# EAGLE design SmartSwitch_i2c_mux (EAGLE 6.4)
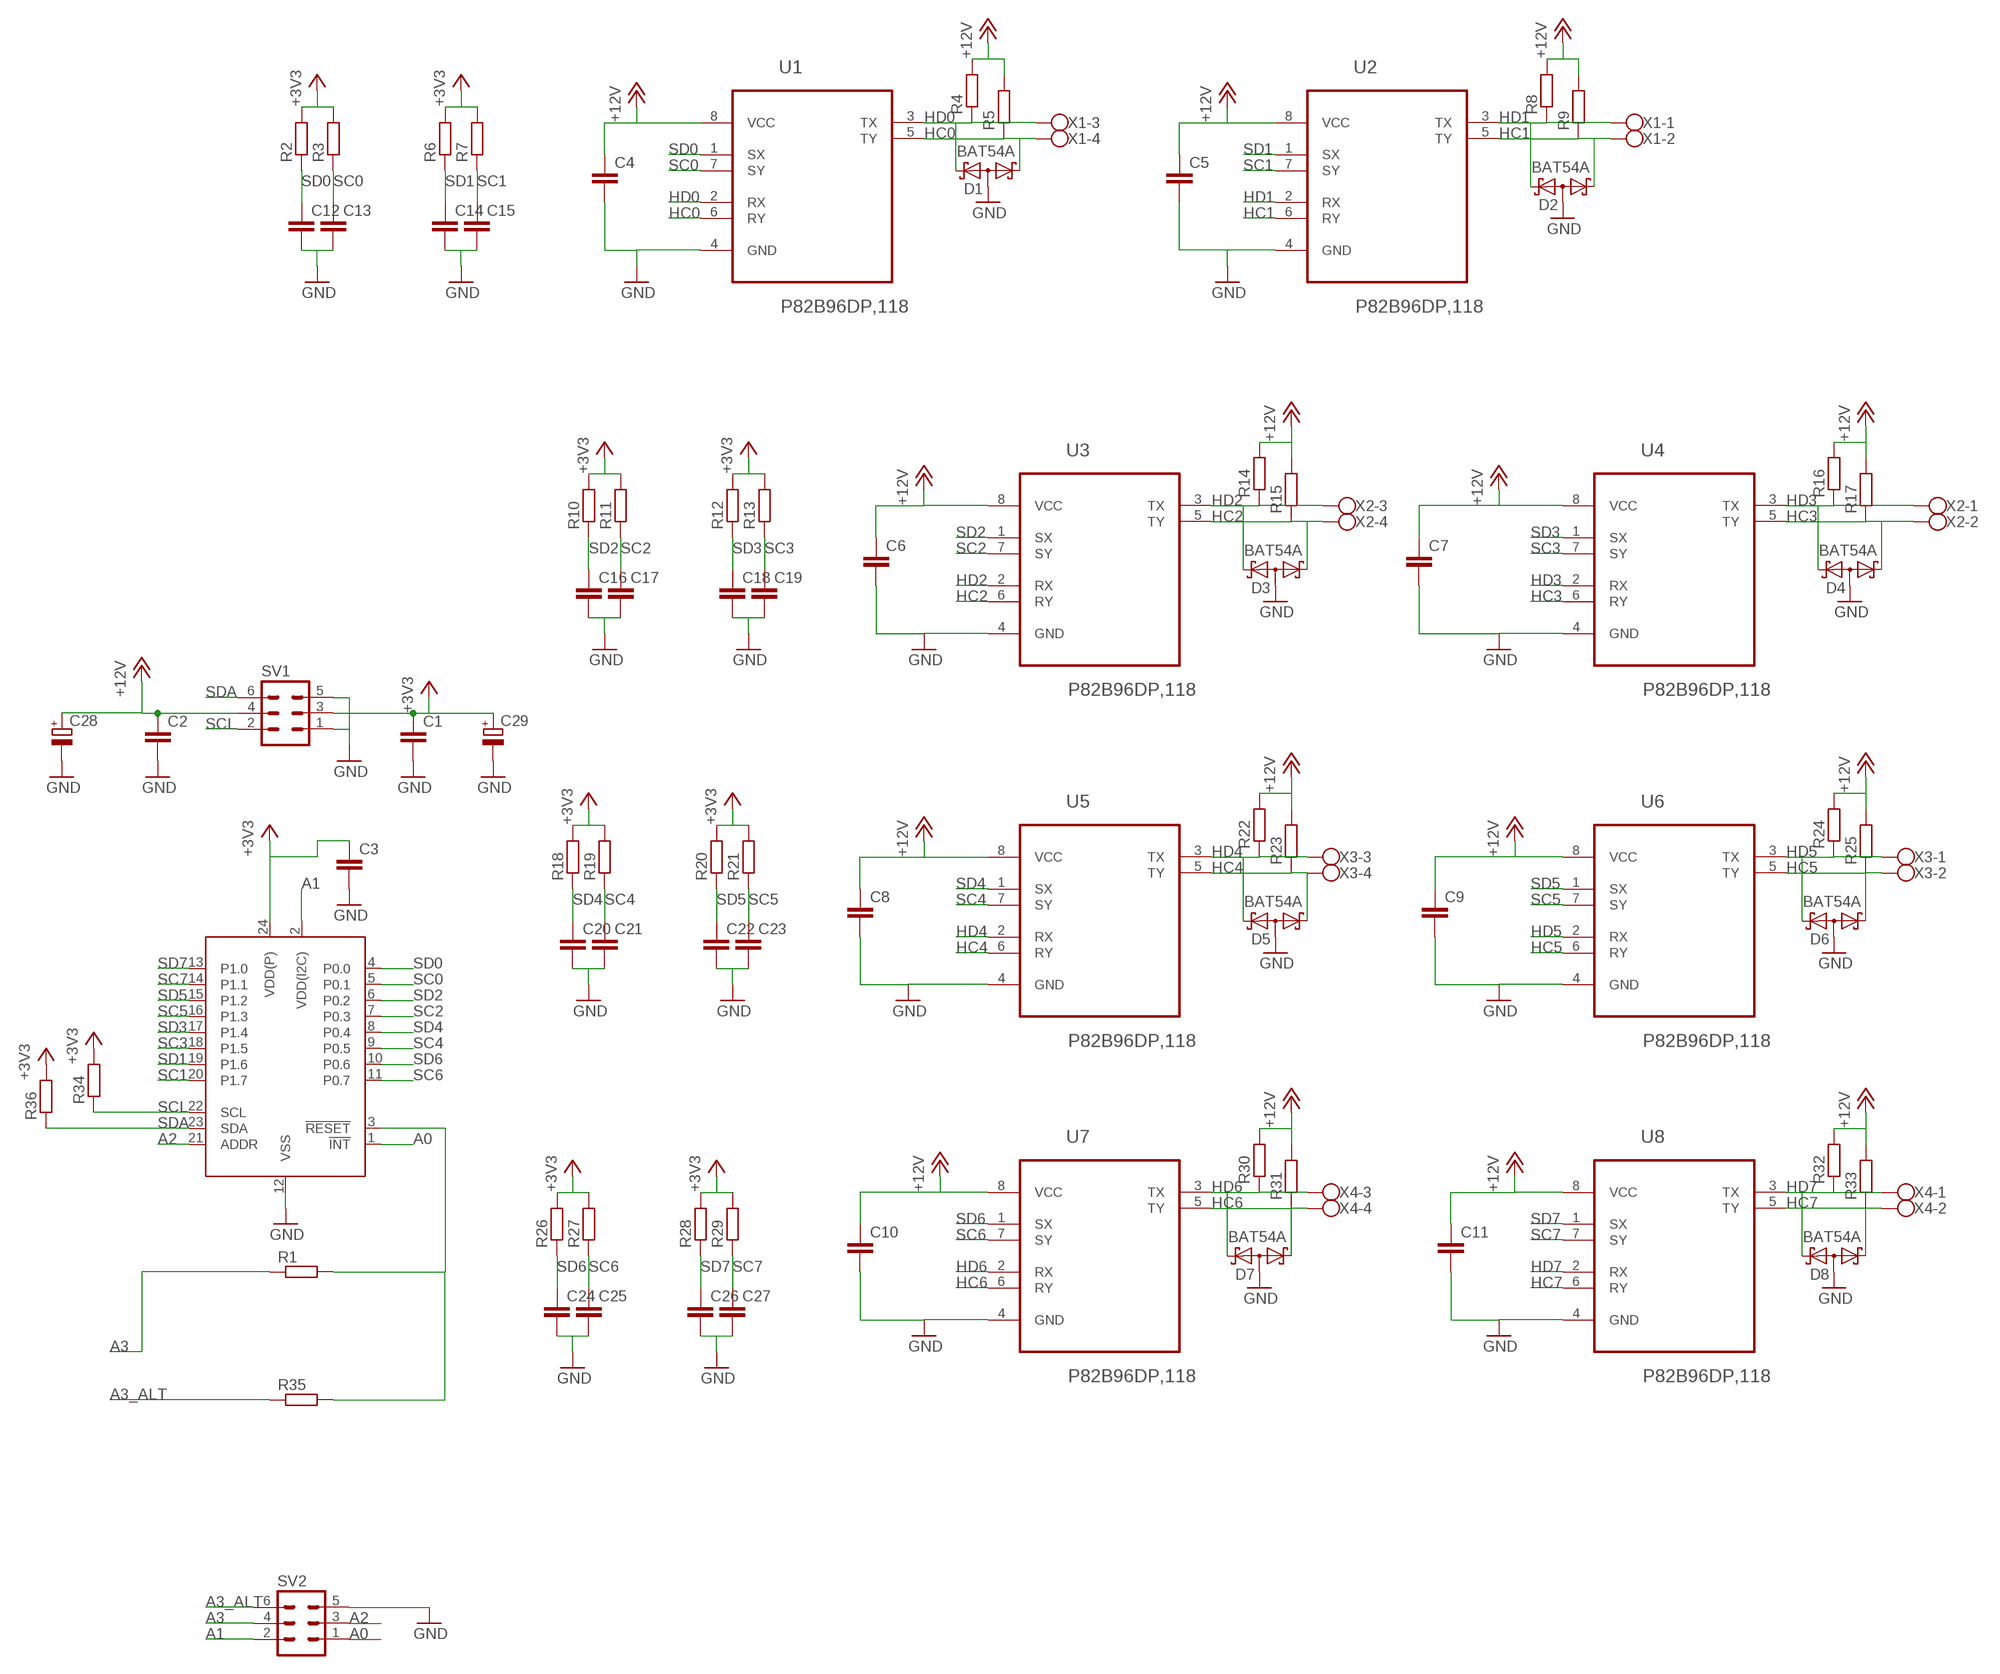
[diagram p0: schematic, sheet 1]

## Parts
C1  C-EUC0805K  [C0805K]
C2  C-EUC0805K  [C0805K]
C3  C-EUC0603K  [C0603K]
C4  C-EUC0603K  [C0603K]
C5  C-EUC0603K  [C0603K]
C6  C-EUC0603K  [C0603K]
C7  C-EUC0603K  [C0603K]
C8  C-EUC0603K  [C0603K]
C9  C-EUC0603K  [C0603K]
C10  C-EUC0603K  [C0603K]
C11  C-EUC0603K  [C0603K]
C12  C-EUC0402  [C0402]
C13  C-EUC0402  [C0402]
C14  C-EUC0402  [C0402]
C15  C-EUC0402  [C0402]
C16  C-EUC0402  [C0402]
C17  C-EUC0402  [C0402]
C18  C-EUC0402  [C0402]
C19  C-EUC0402  [C0402]
C20  C-EUC0402  [C0402]
C21  C-EUC0402  [C0402]
C22  C-EUC0402  [C0402]
C23  C-EUC0402  [C0402]
C24  C-EUC0402  [C0402]
C25  C-EUC0402  [C0402]
C26  C-EUC0402  [C0402]
C27  C-EUC0402  [C0402]
C28  CPOL-EUUD-6,3X7,7  [UD-6,3X7,7_NICHICON]
C29  CPOL-EUUD-6,3X7,7  [UD-6,3X7,7_NICHICON]
D1  BAT54A  [SOT23]
D2  BAT54A  [SOT23]
D3  BAT54A  [SOT23]
D4  BAT54A  [SOT23]
D5  BAT54A  [SOT23]
D6  BAT54A  [SOT23]
D7  BAT54A  [SOT23]
D8  BAT54A  [SOT23]
R1  R-EU_R0402  [R0402]
R2  R-EU_R0603  [R0603]
R3  R-EU_R0603  [R0603]
R4  R-EU_R1206  [R1206]
R5  R-EU_R1206  [R1206]
R6  R-EU_R0603  [R0603]
R7  R-EU_R0603  [R0603]
R8  R-EU_R1206  [R1206]
R9  R-EU_R1206  [R1206]
R10  R-EU_R0603  [R0603]
R11  R-EU_R0603  [R0603]
R12  R-EU_R0603  [R0603]
R13  R-EU_R0603  [R0603]
R14  R-EU_R1206  [R1206]
R15  R-EU_R1206  [R1206]
R16  R-EU_R1206  [R1206]
R17  R-EU_R1206  [R1206]
R18  R-EU_R0603  [R0603]
R19  R-EU_R0603  [R0603]
R20  R-EU_R0603  [R0603]
R21  R-EU_R0603  [R0603]
R22  R-EU_R1206  [R1206]
R23  R-EU_R1206  [R1206]
R24  R-EU_R1206  [R1206]
R25  R-EU_R1206  [R1206]
R26  R-EU_R0603  [R0603]
R27  R-EU_R0603  [R0603]
R28  R-EU_R0603  [R0603]
R29  R-EU_R0603  [R0603]
R30  R-EU_R1206  [R1206]
R31  R-EU_R1206  [R1206]
R32  R-EU_R1206  [R1206]
R33  R-EU_R1206  [R1206]
R34  R-EU_R0603  [R0603]
R35  R-EU_R0402  [R0402]
R36  R-EU_R0603  [R0603]
SV1  MA03-2  [MA03-2]
SV2  MA03-2  [MA03-2]
U1  P82B96DP,118  [SOP65P490X110-8N]
U2  P82B96DP,118  [SOP65P490X110-8N]
U3  P82B96DP,118  [SOP65P490X110-8N]
U4  P82B96DP,118  [SOP65P490X110-8N]
U5  P82B96DP,118  [SOP65P490X110-8N]
U6  P82B96DP,118  [SOP65P490X110-8N]
U7  P82B96DP,118  [SOP65P490X110-8N]
U8  P82B96DP,118  [SOP65P490X110-8N]
U10  PCAL6416APW  [SOT355-1]
X1  W237-4  [W237-4]
X2  W237-4  [W237-4]
X3  W237-4  [W237-4]
X4  W237-4  [W237-4]

## Nets
+3V3: C1.1 C3.1 C29.+ R2.2 R3.2 R6.2 R7.2 R10.2 R11.2 R12.2 R13.2 R18.2 R19.2 R20.2 R21.2 R26.2 R27.2 R28.2 R29.2 R34.2 R36.2 SV1.3 U10.24(VDD(P))
+12V: C2.1 C4.1 C5.1 C6.1 C7.1 C8.1 C9.1 C10.1 C11.1 C28.+ R4.2 R5.2 R8.2 R9.2 R14.2 R15.2 R16.2 R17.2 R22.2 R23.2 R24.2 R25.2 R30.2 R31.2 R32.2 R33.2 SV1.4 U1.8(VCC) U2.8(VCC) U3.8(VCC) U4.8(VCC) U5.8(VCC) U6.8(VCC) U7.8(VCC) U8.8(VCC)
A0: SV2.1 U10.1(!INT!)
A1: SV2.2 U10.2(VDD(I2C))
A2: SV2.3 U10.21(ADDR)
A3: R1.1 SV2.4
A3_ALT: R35.1 SV2.6
GND: C1.2 C2.2 C3.2 C4.2 C5.2 C6.2 C7.2 C8.2 C9.2 C10.2 C11.2 C12.2 C13.2 C14.2 C15.2 C16.2 C17.2 C18.2 C19.2 C20.2 C21.2 C22.2 C23.2 C24.2 C25.2 C26.2 C27.2 C28.- C29.- D1.3(A1A2) D2.3(A1A2) D3.3(A1A2) D4.3(A1A2) D5.3(A1A2) D6.3(A1A2) D7.3(A1A2) D8.3(A1A2) SV1.1 SV1.5 SV2.5 U1.4(GND) U2.4(GND) U3.4(GND) U4.4(GND) U5.4(GND) U6.4(GND) U7.4(GND) U8.4(GND) U10.12(VSS)
HC0: D1.1(K1) R5.1 U1.5(TY) U1.6(RY) X1.4
HC1: D2.1(K1) R9.1 U2.5(TY) U2.6(RY) X1.2
HC2: D3.1(K1) R15.1 U3.5(TY) U3.6(RY) X2.4
HC3: D4.1(K1) R17.1 U4.5(TY) U4.6(RY) X2.2
HC4: D5.1(K1) R23.1 U5.5(TY) U5.6(RY) X3.4
HC5: D6.1(K1) R25.1 U6.5(TY) U6.6(RY) X3.2
HC6: D7.1(K1) R31.1 U7.5(TY) U7.6(RY) X4.4
HC7: D8.1(K1) R33.1 U8.5(TY) U8.6(RY) X4.2
HD0: D1.2(K2) R4.1 U1.2(RX) U1.3(TX) X1.3
HD1: D2.2(K2) R8.1 U2.2(RX) U2.3(TX) X1.1
HD2: D3.2(K2) R14.1 U3.2(RX) U3.3(TX) X2.3
HD3: D4.2(K2) R16.1 U4.2(RX) U4.3(TX) X2.1
HD4: D5.2(K2) R22.1 U5.2(RX) U5.3(TX) X3.3
HD5: D6.2(K2) R24.1 U6.2(RX) U6.3(TX) X3.1
HD6: D7.2(K2) R30.1 U7.2(RX) U7.3(TX) X4.3
HD7: D8.2(K2) R32.1 U8.2(RX) U8.3(TX) X4.1
N$1: R1.2 R35.2 U10.3(!RESET!)
SC0: C13.1 R3.1 U1.7(SY) U10.5(P0.1)
SC1: C15.1 R7.1 U2.7(SY) U10.20(P1.7)
SC2: C17.1 R11.1 U3.7(SY) U10.7(P0.3)
SC3: C19.1 R13.1 U4.7(SY) U10.18(P1.5)
SC4: C21.1 R19.1 U5.7(SY) U10.9(P0.5)
SC5: C23.1 R21.1 U6.7(SY) U10.16(P1.3)
SC6: C25.1 R27.1 U7.7(SY) U10.11(P0.7)
SC7: C27.1 R29.1 U8.7(SY) U10.14(P1.1)
SCL: R34.1 SV1.2 U10.22(SCL)
SD0: C12.1 R2.1 U1.1(SX) U10.4(P0.0)
SD1: C14.1 R6.1 U2.1(SX) U10.19(P1.6)
SD2: C16.1 R10.1 U3.1(SX) U10.6(P0.2)
SD3: C18.1 R12.1 U4.1(SX) U10.17(P1.4)
SD4: C20.1 R18.1 U5.1(SX) U10.8(P0.4)
SD5: C22.1 R20.1 U6.1(SX) U10.15(P1.2)
SD6: C24.1 R26.1 U7.1(SX) U10.10(P0.6)
SD7: C26.1 R28.1 U8.1(SX) U10.13(P1.0)
SDA: R36.1 SV1.6 U10.23(SDA)

## Library data of the parts
C1-C27 = billyInd:C-EU: CAPACITOR, European symbol
C28 C29 = billyInd:CPOL-EU: POLARIZED CAPACITOR, European symbol
D1-D8 = NXP_60_26022015:BAT54A: Schottky barrier (double) diodes Planar Schottky barrier diodes encapsulated in a SOT23 small plastic SMD package. Single diodes and double diodes with different pinning are available. AAL Eindhoven MK
R1-R36 = billyInd:R-EU_: RESISTOR, European symbol
SV1 SV2 = con-lstb:MA03-2: PIN HEADER; OC_FARNELL: unknown; OC_NEWARK: unknown
U1-U8 = NXP_By_element14_Batch_1:P82B96DP,118: Dual bidirectional bus buffer; MPN: P82B96DP,118; OC_FARNELL: 1831235; OC_NEWARK: 70R8458; PACKAGE: TSSOP-8; SUPPLIER: NXP Semiconductors
U10 = NXP_60_26022015:PCAL6416A: Low-voltage translating 16-bit I2C-bus/SMBus I/O expander with interrupt output, reset, and configuration registers The PCAL6416A is a 16-bit general-purpose I/O expander that provides remote I/O expansion for most microcontroller families via the I2C-bus interface. NXP I/O expanders provide a simple solution when additional I/Os are needed while keeping interconnections to a minimum, for example, in battery-powered mobile applications for interfacing to sensors, push buttons, keypad, etc. In addition to providing a flexible set of GPIOs, it simplifies interconnection of a processor running at one voltage level to I/O devices operating at a different (usually higher) voltage level. The PCAL6416A has built-in level shifting feature that makes these devices extremely flexible in mixed signal environments where communication between incompatible I/O voltages is required. Its wide VDD range of 1.65 V to 5.5 V on the dual power rail allows seamless communications with next-generation low voltage microprocessors and microcontrollers on the interface side (SDA/SCL) and peripherals at a higher voltage on the port side. There are two supply voltages for PCAL6416A: VDD(I2C-bus) and VDD(P). VDD(I2C-bus) provides the supply voltage for the interface at the master side (for example, a microcontroller) and the VDD(P) provides the supply for core circuits and Port P. The bidirectional voltage level translation in the PCAL6416A is provided through VDD(I2C-bus). VDD(I2C-bus) should be connected to the VDD of the external SCL/SDA lines. This indicates the VDD level of the I2C-bus to the PCAL6416A, while the voltage level on Port P of the PCAL6416A is determined by the VDD(P). The PCAL6416A contains the PCA6416A register set of four pairs of 8-bit Configuration, Input, Output, and Polarity Inversion registers and additionally, the PCAL6416A has Agile I/O, which are additional features specifically designed to enhance the I/O. These additional features are: programmable output drive strength, latchable inputs, programmable pull-up/pull-down resistors, maskable interrupt, interrupt status register, programmable open-drain or push-pull outputs. The PCAL6416A is a pin-to-pin replacement to the PCA6416A, however, the PCAL6416A powers up with all I/O interrupts masked. This mask default allows for a board bring-up free of spurious interrupts at power-up. At power-on, the I/Os are configured as inputs. However, the system master can enable the I/Os as either inputs or outputs by writing to the I/O configuration bits. The data for each input or output is kept in the corresponding input or output register. The polarity of the Input Port register can be inverted with the Polarity Inversion register, saving external logic gates. Programmable pull-up and pull-down resistors eliminate the need for discrete components. AAL Eindhoven MK
X1-X4 = strip_connector_billy:W237-4: WAGO SCREW CLAMP; OC_FARNELL: unknown; OC_NEWARK: unknown

## Board
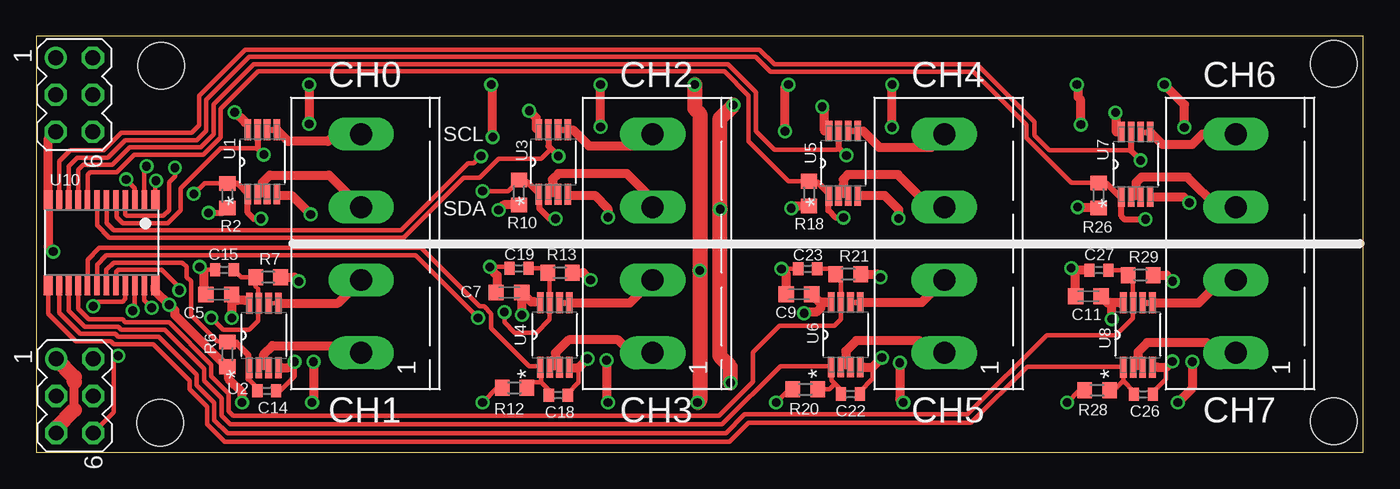
[diagram p1: board, top side]
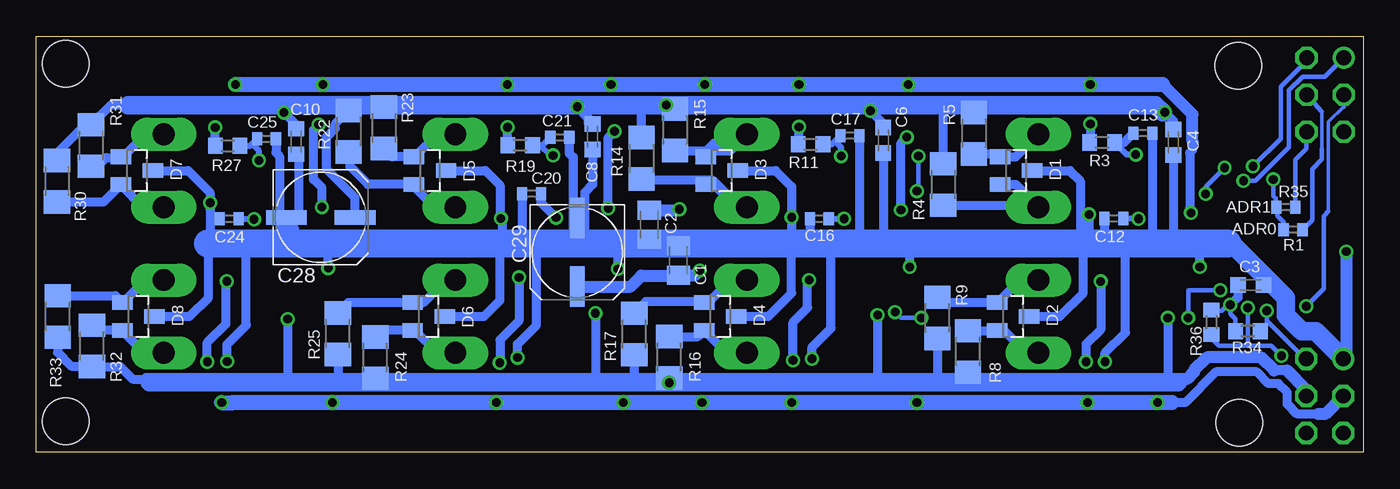
[diagram p2: board, bottom side, seen from below]

Size 91 x 28.5 mm. Coordinates in mm from the lower left corner, seen from the top.
Outline: 0,0 91,0 91,28.5 0,28.5 0,0
Copper layers (1*16): Top 0.0356mm / dielectric 1.5011mm / Bottom 0.0356mm
Design rules "LaenPCBOrder *": minimum track width 6mil, minimum drill 13mil, track to track 6mil, track to pad 6mil, pad to pad 6mil, via to via 6mil, smd to smd 6mil, copper to edge 15mil, drill to drill 6mil, minimum pad ring 7mil, minimum via ring 7mil, stop-mask expansion 4mil, vias tented up to drill 24mil, thermal gap 10mil
Holes 3.2 mm at 8.5,2 8.55,26.5 89,2.12 89,26.62

### Footprints (pad centres in the part's own frame; a part is rotated, then mirrored left to right if it is on the bottom)
C0805K = smd 1.3 x 1.6: 1 -1,0; 2 1,0
C0603K = smd 1.05 x 1.08: 1 -0.875,0; 2 0.875,0
C0402 = smd 0.7 x 0.9: 1 -0.65,0; 2 0.65,0
UD-6,3X7,7_NICHICON = smd 2.8 x 1: + 2.35,0; - -2.35,0
SOT23 = smd 1 x 1.4: 1 -0.95,-1.1; 2 0.95,-1.1; 3 0,1.1
R0402 = smd 0.7 x 0.9: 1 -0.65,0; 2 0.65,0
R0603 = smd 1 x 1.1: 1 -0.85,0; 2 0.85,0
R1206 = smd 1.6 x 1.803: 1 -1.422,0; 2 1.422,0
MA03-2 = drill 1.016: 1 -2.54,-1.27 | drill 1.016 octagon: 2 -2.54,1.27; 3 0,-1.27; 4 0,1.27; 5 2.54,-1.27; 6 2.54,1.27
SOP65P490X110-8N = smd 1.422 x 0.457: 1 -2.21,0.991; 2 -2.21,0.33; 3 -2.21,-0.33; 4 -2.21,-0.991; 5 2.21,-0.991; 6 2.21,-0.33; 7 2.21,0.33; 8 2.21,0.991
SOT355-1 = smd 0.6 x 1.35: 1 -3.675,-2.925; 12 3.675,-2.925; 13 3.675,2.925; 24 -3.675,2.925 | smd 0.4 x 1.35: 2 -2.925,-2.925; 3 -2.275,-2.925; 4 -1.625,-2.925; 5 -0.975,-2.925; 6 -0.325,-2.925; 7 0.325,-2.925; 8 0.975,-2.925; 9 1.625,-2.925; 10 2.275,-2.925; 11 2.925,-2.925; 14 2.925,2.925; 15 2.275,2.925; 16 1.625,2.925; 17 0.975,2.925; 18 0.325,2.925; 19 -0.325,2.925; 20 -0.975,2.925; 21 -1.625,2.925; 22 -2.275,2.925; 23 -2.925,2.925
W237-4 = drill 1.5 long: 1 -7.5,-1.27; 2 -2.5,-1.27; 3 2.5,-1.27; 4 7.5,-1.27

### Placement (x,y rotation side)
C1  46.96,13.14 90 bottom
C2  48.96,15.59 270 bottom
C3  7.71,11.46 0 bottom
C4  13.01,21.24 270 bottom
C5  12.51,10.81 180 top
C6  32.91,21.38 270 bottom
C7  32.41,10.95 180 top
C8  52.85,21.62 270 bottom
C9  52.31,10.83 180 top
C10  73.19,21.3 270 bottom
C11  72.15,10.69 180 top
C12  17.1,16.02 180 bottom
C13  15.1,21.87 0 bottom
C14  15.8,4.2 0 top
C15  12.9,12.5 180 top
C16  37.3,16 180 bottom
C17  35.2,21.7 0 bottom
C18  35.8,3.9 0 top
C19  33.1,12.6 180 top
C20  57.04,17.72 180 bottom
C21  55.1,21.58 0 bottom
C22  55.84,3.98 0 top
C23  52.9,12.56 180 top
C24  77.78,16 180 bottom
C25  75.22,21.48 0 bottom
C26  75.92,3.96 0 top
C27  72.88,12.48 180 top
C28  71.5,16.1 0 bottom
C29  53.9,13.7 270 bottom
D1  23.8,19.3 270 bottom
D2  24,9.3 270 bottom
D3  44,19.3 270 bottom
D4  44.1,9.3 270 bottom
D5  64,19.3 270 bottom
D6  64.1,9.3 270 bottom
D7  84.1,19.3 270 bottom
D8  84,9.3 270 bottom
R1  4.8,15.25 180 bottom
R2  13.1,17.58 270 top
R3  17.9,21.23 180 bottom
R4  28.8,18.35 90 bottom
R5  26.7,21.87 90 bottom
R6  13.1,6.7 270 top
R7  15.9,12 0 top
R8  27.1,6.9 270 bottom
R9  29.2,9.2 270 bottom
R10  33.1,17.8 270 top
R11  37.9,21.1 180 bottom
R12  32.8,4.4 180 top
R13  35.92,12.3 0 top
R14  49.5,20.15 90 bottom
R15  47.2,22.1 90 bottom
R16  47.6,6.5 270 bottom
R17  50,8.1 270 bottom
R18  53,17.72 270 top
R19  57.82,21.04 180 bottom
R20  52.74,4.3 180 top
R21  55.68,12.2 0 top
R22  69.58,22 90 bottom
R23  67.16,22.24 90 bottom
R24  67.76,6.48 270 bottom
R25  70.32,8.12 270 bottom
R26  72.86,17.6 270 top
R27  77.88,21 180 bottom
R28  72.76,4.24 180 top
R29  75.74,12.14 0 top
R30  89.6,18.58 90 bottom
R31  87.26,21.02 90 bottom
R32  87.2,7.28 270 bottom
R33  89.54,9.3 270 bottom
R34  7.9,8.3 180 bottom
R35  5.3,16.8 180 bottom
R36  10.4,8.9 90 bottom
SV1  2.62,3.85 270 top
SV2  2.6,24.5 270 top
U1  15.5,19.9 90 top
U2  15.6,8 90 top
U3  35.45,19.89 90 top
U4  35.55,8.03 90 top
U5  55.35,19.81 90 top
U6  55.51,8.05 90 top
U7  75.41,19.73 90 top
U8  75.55,8.03 90 top
U10  4.48,14.37 180 top
X1  21,14.3 90 top
X2  41,14.3 90 top
X3  61,14.3 90 top
X4  81,14.3 90 top

### Tracks (layer width: path | path; a pad name or v marks a point on that pad's centre or on a via)
+3V3  (via drill 0.6)
  Top 0.305: R12.2 31.6,4.4 v30.6,3.4 | R20.2 51.64,4.3 v50.74,3.4 | R28.2 71.54,4.24 v70.7,3.4
  Top 0.406: v11.8,16.4 12.77,16.4 R2.2
  Top 0.61: v19,6.2 19,3.5 v18.9,3.4 | v18.7,25.2 v18.7,22.5 | v38.7,22.3 v38.7,25.2 | R10.2 32.05,16.95 v31.7,16.6 | v31.3,21.6 31.3,25.1 v31.2,25.2 | v39.1,6.3 39.1,3.5 v39.2,3.4 | v14.1,3.4 14.1,4.1 13.2,5 13.2,5.75 R6.2 13.05,5.85 9.5,9.4 9.5,9.7 v9.1,10.1 8.15,11.04 U10.24 | v58.68,22.28 58.68,25.18 v58.7,25.2 | R18.2 51.93,16.87 v51.78,16.72 | v51.34,22 51.34,24.96 v51.58,25.2 | R21.2 57.68,12.2 v57.9,11.98 | v59.22,6.12 59.22,3.64 v59.46,3.4 | v78.74,22.26 78.74,23.82 v77.36,25.2 | R26.2 71.47,16.75 v71.42,16.8 | v71.36,25.2 71.44,25.12 71.44,24.36 71.6,24.2 71.6,22.5 v71.64,22.46 | v79.28,6.2 79.28,4.38 v78.3,3.4 | R13.2 37.5,12.3 v38,11.8 | R7.2 17.7,12 v18,11.7 | R29.2 77.52,12.14 v77.94,11.72
  Top 1.016: v45.15,25.2 45.15,23.55 45.5,23.2 v45.5,12.45 45.5,3.55 v45.35,3.4
  Bottom 0.254: 15.68,25.22 14.14,25.24 14.56,25.1 | v71.64,22.46 71.64,22.34 72,22.1
  Bottom 0.305: 75.44,3.34 77.52,3.4 | 10.05,10.1 R36.2 10.35,9.7 9.7,9.7 9.3,10.1 v9.1,10.1 9.1,9.5 8.75,9.15 R34.2
  Bottom 0.406: 11.7,16.5 v11.8,16.4 11.7,16.3 | 11.88,17.78 11.88,17.18 11.8,16.3 11.7,16.3 | 11.9,16.7 11.7,16.3
  Bottom 0.61: v18.7,22.5 18.7,21.48 R3.2 | R11.2 38.7,21.1 v38.7,22.3 | v31.7,16.6 31.7,21.2 v31.3,21.6 | 11.7,21.3 11.7,20.7 11.9,20.5 11.9,16.7 11.9,16.5 v11.8,16.4 | 3.1,2.6 4.5,2.6 5.2,3.3 5.2,4.1 5.8,4.7 6.5,4.7 7.3,5.5 10.1,5.5 12.2,3.4 13.1,3.4 | R19.2 v58.67,22.27 v58.68,22.28 | v51.78,16.72 51.78,21.56 v51.34,22 | R27.2 v78.73,22.25 v78.74,22.26 | v39.1,6.3 39.1,8.9 38.1,9.9 38.1,11.7 v38,11.8 | v18,11.7 18,8.4 19,7.4 v19,6.2 | v57.9,11.98 57.9,9 59.2,7.7 59.2,6.14 v59.22,6.12 | v79.28,6.2 79.28,7.52 78,8.8 78,11.66 v77.94,11.72 | C3.1 8.59,10.62 v9.1,10.1 | v71.42,16.8 71.42,18.12 72,18.7 72,22.1 v71.64,22.46
  Bottom 0.813: SV1.3 2.6,2.6 3.1,2.6 | 11.7,21.3 11.7,23.16 13.74,25.2 15.66,25.2 15.68,25.22 | v45.5,12.45 45.81,12.14 C1.1 47,12.1 49.5,12.1 50.25,11.35 C29.+
  Bottom 1.016: 13.1,3.4 v14.1,3.4 v18.9,3.4 v30.6,3.4 v39.2,3.4 v45.35,3.4 v50.74,3.4 v59.46,3.4 v70.7,3.4 77.52,3.4 v78.3,3.4 | 13.74,25.2 v18.7,25.2 v31.2,25.2 v38.7,25.2 v45.15,25.2 v51.58,25.2 v58.7,25.2 v71.36,25.2 v77.36,25.2
+12V  (via drill 0.6)
  Top 0.305: U1.8 | 13.38,9.21 v13.4,9.2 | U2.8 14.49,10.21 14.3,10.4 | U4.8 34.26,10.24 34.2,10.3 | U6.8 54.22,10.26 | 54.22,10.26 | U8.8 74.2,10.24 74.32,10.24
  Top 0.406: U1.8 14.51,22.39 14.3,22.6 | U3.8 34.4,22.1 34.3,22.2 | U5.8 54.06,22.02 | 54.06,22.02 | U7.8 74.08,21.94 | 74.08,21.94
  Top 0.61: 13.38,9.21 C5.1 13.79,10.4 14.3,10.4 | 34.2,10.3 33.94,10.3 C7.1 33.28,9.41 v33.3,9.4 | 14.3,22.6 v13.6,23.3 | 34.3,22.2 34.3,22.9 v33.8,23.4 | 54.22,10.26 53.76,10.26 C9.1 53.19,10.81 53.78,10.22 53.78,9.88 53.5,9.6 52.74,9.6 v52.66,9.52 | 74.08,21.94 74.08,23.22 v74.02,23.28 | 74.32,10.24 73.68,10.24 | 73.68,10.24 73.47,10.24 C11.1 73.03,10.46 | v73.76,9.12 73.76,10.16 73.68,10.24 | 54.06,22.02 54.06,23.52 v53.9,23.68
  Top 1.016: v47.6,4.75 47.6,5.85 46.9,6.55 v46.9,16.65 46.9,22.9 v47.8,23.8
  Bottom 0.305: 13.4,5 13.6,4.8 28.8,4.8 | 14.25,23.8 14.2,23.8 13.65,23.25
  Bottom 0.406: v13.6,23.3 13.99,23.82 13.74,23.3 | R5.2 26,23.7 26.1,23.8
  Bottom 0.61: R8.2 26.1,4.8 | v13.4,9.2 13.4,5 | C4.1 13.01,22.71 v13.6,23.3 | 33.7,23.8 33.8,23.7 v33.8,23.4 32.91,22.51 C6.1 | R14.2 49.5,23.7 47.5,23.8 | R15.2 46.72,23.52 47,23.8 | v33.3,9.4 33.3,4.8 | R17.2 50,4.8 | R16.2 46.22,4.98 46.6,4.8 | 53.54,23.8 53.9,23.64 v53.9,23.68 53.12,22.89 53.12,22.5 C8.1 | R23.2 65.1,23.56 64.86,23.8 | 68.28,23.5 67.98,23.8 | R24.2 65.44,5.06 65.18,4.8 | 68.22,4.9 68.32,4.8 | 73.82,23.8 74.02,23.6 v74.02,23.28 73.22,22.48 C10.1 | 83.2,4.8 83.2,4.84 83.48,5.12 83.6,5 84.4,5 85.26,5.86 R32.2 87.24,5.9 88.6,5.9 89.54,6.84 R33.2 | v73.76,9.12 73.76,5.02 73.54,4.8 | R9.2 29.2,5.2 28.8,4.8 | R4.2 28.8,23.7 28.7,23.8 | 69.3,23.8 69.58,23.52 R22.2 70.5,22.5 70.5,22.2 71.1,21.6 71.1,19.4 69.15,17.45 C28.+ | R25.2 70.32,4.92 70.2,4.8 | 84.7,23.8 85.9,23.8 R31.2 87.66,22.44 89.5,20.6 89.5,20.1 R30.2 | v52.66,9.52 52.66,4.94 52.8,4.8
  Bottom 0.7: 5.2,5.6 6.1,5.6
  Bottom 0.813: SV1.4 3.89,4.29 5.2,5.6 | 12.7,4.8 12.5,5 12.1,5 11.6,5.5 11.6,5.6 10.7,6.5 7,6.5 6.1,5.6 | C2.1 46.96,16.59 v46.9,16.65
  Bottom 1.016: 48,4.8 47.65,4.8 v47.6,4.75
  Bottom 1.27: 13.74,23.3 14.25,23.8 26.1,23.8 28.7,23.8 33.7,23.8 47,23.8 47.5,23.8 v47.8,23.8 53.54,23.8 64.86,23.8 67.98,23.8 69.3,23.8 73.82,23.8 84.7,23.8 | 12.7,4.8 13.6,4.8 26.1,4.8 28.8,4.8 33.3,4.8 46.6,4.8 48,4.8 50,4.8 52.8,4.8 65.18,4.8 68.32,4.8 70.2,4.8 73.54,4.8 83.2,4.8 83.24,4.8
A0  (via drill 0.6)
  Top 0.305: U10.1 8.15,18.45 v8.2,18.6
  Bottom 0.305: SV2.1 2.62,25.75 4.15,25.75 5.1,24.8 5.1,20.9 7.4,18.6 v8.2,18.6
A1  (via drill 0.6)
  Top 0.305: U10.2 7.41,19.45 v7.55,19.6
  Bottom 0.305: SV2.2 3.87,26.83 5.65,25.05 5.65,21.5 v7.55,19.6
A2  (via drill 0.6)
  Top 0.305: U10.21 6.11,10.51 5.9,10.3 4.2,10.3 v3.9,10
  Bottom 0.254: 1.33,23.67 2.38,22.65 2.38,16.5
  Bottom 0.305: SV2.3 1.33,23.67 | v3.9,10 2.7,11.2 2.7,16.18 2.38,16.5
A3
  Bottom 0.254: 2.82,20.8 2.82,23.33
  Bottom 0.305: 2.82,23.33 SV2.4 | 2.82,20.8 2.82,20.08 3.5,19.4 3.5,15.9 R1.1
A3_ALT
  Bottom 0.305: R35.1 4.65,20.05 3.9,20.8 3.9,21.93 SV2.6
GND  (via drill 0.6)
  Top 0.305: U1.4 16.51,17.69 16.6,17.6 | C15.2 11.4,12.5 v11.2,12.7 | C5.2 11.49,10.81 | v17.7,6.2 17.7,5.2 16.7,4.2 C14.2 | U2.4 16.79,5.79 16.8,5.8 | v31.1,12.7 32.35,12.7 C19.2 | C18.2 36.45,4.05 37.2,4.8 37.2,5.8 | U4.4 36.68,5.82 36.7,5.8 | U5.4 56.56,17.6 | 56.56,17.6 | U6.4 56.74,5.84 56.76,5.82 | C22.2 56.49,4.15 57.36,5.02 57.36,5.8 57.34,5.82 | C23.2 v51.1,12.56 | U7.4 76.6,17.52 76.62,17.5 | U8.4 76.86,5.82 | 76.86,5.82 | C26.2 76.57,4.09 77.48,5 77.48,5.78 77.52,5.82
  Top 0.406: U3.4 36.42,17.68 36.5,17.6
  Top 0.61: 16.6,17.6 17.5,17.6 v18.8,16.3 | 11.49,10.81 11.49,12.41 v11.2,12.7 | 36.5,17.6 38.3,17.6 39.2,16.7 v39.2,16.1 | 16.8,5.8 17.3,5.8 v17.7,6.2 | v31.1,12.7 31.1,12.6 31.6,12.1 31.6,11.02 C7.2 | v37.8,6.4 37.2,5.8 36.7,5.8 | 2.6,2.9 2.6,4.8 | SV2.5 0.81,21.43 U10.12 0.81,14.1 v1.15,13.75 | 56.56,17.6 58.18,17.6 59.14,16.64 v59.14,16.02 | 56.76,5.82 57.34,5.82 v58,6.48 | C9.2 51.44,12.22 v51.1,12.56 | 76.62,17.5 78.68,17.5 v79.08,17.1 | 76.86,5.82 77.52,5.82 v77.92,6.22 | C11.2 71.28,12.32 v70.98,12.62 71.12,12.48 C27.2
  Top 1.016: SV1.5 1.35,1.65 2.6,2.9 | 2.6,4.8 2.6,5.14 SV1.1
  Bottom 0.305: 11.2,14.1 11,14.3 | 9.8,14.1 10,14.3
  Bottom 0.406: 13.5,14.5 13.7,14.3 | 11.9,14.4 12,14.3 | 18.3,14.9 18.1,14.7 17.7,14.3 | 1.16,12.56 1.16,12.76 v1.15,13.75 | C24.2 78.98,16 79.08,15.9 | C2.2 49.6,14.59 49.6,14.3
  Bottom 0.61: 12.21,14.31 12.2,14.3 | v18.8,16.3 18.8,14.3 | v11.2,12.7 11.2,14.1 | C13.2 14.45,14.35 14.4,14.3 | C12.2 17.75,15.05 18.1,14.7 | C4.2 13.01,14.99 13.5,14.5 | C6.2 32.91,14.49 33.1,14.3 | C17.2 34.55,14.45 34.4,14.3 | C16.2 37.95,14.45 38.1,14.3 | v31.1,12.7 31.1,14.1 30.9,14.3 | 37.8,14 37.5,14.3 | C3.2 6.5,11.8 | 1.15,6.59 SV1.1 | 59.06,14.9 59.06,16.02 v59.14,16.02 59.2,16.08 59.2,18.3 60.2,19.3 D5.3 | 59.06,14.9 59.06,14.3 | 52.85,14.41 52.96,14.3 | C21.2 54.45,20.49 54.18,20.22 54.18,15.3 | 54.18,15.3 54.18,14.38 54.26,14.3 | 58,14.12 57.82,14.3 57.69,14.43 C20.2 | v51.1,12.56 51.1,13.8 50.6,14.3 | 77.83,14.39 77.74,14.3 | 79.24,14.3 79.08,14.46 79.08,15.9 v79.08,17.1 79.1,16.72 79.1,17.8 80.6,19.3 D7.3 | C25.2 74.57,20.53 74.32,20.28 74.32,14.4 74.22,14.3 | 72.89,14.33 72.92,14.3 | 77.92,14.18 78.04,14.3 | v70.98,12.62 70.98,14.2 70.88,14.3 | D1.3 20.1,19.3 19.4,18.6 19.4,14.4 19.3,14.3 19.6,14 | D2.3 20.8,9.3 19.2,10.9 19.2,13.8 18.7,14.3 | D3.3 40.3,19.3 39.2,18.2 v39.2,16.1 39.2,14.3 39.2,10.9 40.8,9.3 D4.3 | v37.8,6.4 37.8,7.2 36.5,8.5 36.5,14.1 36.3,14.3 | v17.7,6.2 17.7,6.8 16.3,8.2 16.3,14.1 16.1,14.3 | v58,6.48 58,7.4 56.7,8.7 56.7,13.9 56.3,14.3 | D6.3 60.3,9.3 59.2,10.4 59.2,14.76 59.06,14.9 | v77.92,6.22 77.92,7.38 76.6,8.7 76.6,13.8 76.1,14.3 | D8.3 80.5,9.3 79.2,10.6 79.2,14.1 79,14.3 | C10.2 73,20.43 73,16.1 C28.- | C29.- 53.9,15.58 54.18,15.3 | C8.2 52.85,18.35 53.4,17.8 53.4,14.3 | C1.2 47.84,14.14 48,14.3
  Bottom 0.813: v1.15,13.75 1.15,6.59
  Bottom 1.016: 49.96,14.41 49.85,14.3 | C28.- 73.85,15.65 73.5,15.3 73.5,14.6 73.2,14.3
  Bottom 1.27: 9.3,14.3 9,14.3 6.5,11.8 5.3,10.6 5.3,9.4 4.2,8.3 3.26,8.3 SV1.1
  Bottom 1.93: 9.3,14.3 10,14.3 11,14.3 12,14.3 12.2,14.3 13.7,14.3 14.4,14.3 16.1,14.3 17.7,14.3 18.7,14.3 18.8,14.3 19.3,14.3 30.9,14.3 33.1,14.3 34.4,14.3 36.3,14.3 37.5,14.3 38.1,14.3 39.2,14.3 48,14.3 49.6,14.3 49.85,14.3 50.6,14.3 52.96,14.3 53.4,14.3 54.26,14.3 56.3,14.3 57.82,14.3 59.06,14.3 70.88,14.3 72.92,14.3 73.2,14.3 74.22,14.3 76.1,14.3 77.74,14.3 78.04,14.3 79,14.3 79.24,14.3
HC0
  Top 0.406: U1.6 U1.5
  Top 0.61: X1.4 20.5,21.8 20,21.3 17.27,21.3 U1.5
  Bottom 0.61: 23.62,20.45 X1.4 23.82,20.25 D1.1 25.1,20.45 R5.1
HC1
  Top 0.305: U2.6 U2.5
  Top 0.61: U2.5 20.68,10.21 X1.2
  Bottom 0.61: X1.2 23.55,11.8 D2.1 28.83,10.25 R9.1
HC2
  Top 0.406: U3.6 U3.5
  Top 0.61: U3.5 36.8,22.1 37.9,21 41.47,21 X2.4
  Bottom 0.61: R15.1 43.39,20.68 X2.4 42.87,21.2 44.5,21.2 45.1,20.6 D3.1
HC3
  Top 0.406: U4.6 U4.5
  Top 0.61: U4.5 40.71,10.24 X2.2
  Bottom 0.61: X2.2 43.4,11.8 44.95,10.25 D4.1 45.27,10.32 49.2,10.32 R17.1
HC4
  Top 0.406: U5.6 U5.5
  Top 0.61: U5.5 56.7,22.02 57.82,20.9 61.37,20.9 X3.4
  Bottom 0.61: X3.4 63.5,21.8 65.05,20.25 D5.1 66.59,20.25 R23.1
HC5
  Top 0.406: U6.6 U6.5
  Top 0.61: U6.5 60.73,10.26 X3.2
  Bottom 0.61: 62.29,11.78 X3.2 62.9,11.8 64.45,10.25 D6.1 69.61,10.25 R25.1
HC6
  Top 0.406: U7.6 U7.5
  Top 0.61: X4.4 79.98,21.8 79.26,21.08 77.26,21.08 U7.5
  Bottom 0.61: X4.4 83.5,21.8 85.05,20.25 D7.1 85.25,20.2 86.2,20.2 86.8,19.6 R31.1
HC7
  Top 0.406: U8.6 U8.5
  Top 0.61: X4.2 81.28,11.8 79.72,10.24 U8.5
  Bottom 0.61: R33.1 85.57,10.72 D8.1 83.55,11.8 X4.2
HD0
  Top 0.305: U1.3 15.71,17.69 15.5,17.9
  Top 0.406: U1.2 U1.3
  Top 0.61: 15.5,17.9 15.5,18.5 16,19 20.07,19 X1.3
  Bottom 0.61: R4.1 22.4,16.93 X1.3 23.82,18.35 D1.2
HD1
  Top 0.305: U2.2 U2.3 15.81,5.79 15.6,6
  Top 0.61: 15.6,6 15.6,6.7 16.2,7.3 21.77,7.3 X1.1
  Bottom 0.61: X1.1 22.37,6.7 23,6.7 24.65,8.35 D2.2 25.13,8.32 R8.1
HD2
  Top 0.406: 35.4,18.1 35.4,17.96 U3.2 U3.3
  Top 0.61: X2.3 42.27,17.33 40.5,19.1 35.8,19.1 35.4,18.7 35.4,18.1
  Bottom 0.61: D3.2 44.55,18.35 43.8,17.6 43.07,17.6 X2.3 42.77,16.8 44.6,18.63 49.4,18.63 R14.1
HD3
  Top 0.406: 35.6,6.5 35.6,6.1 U4.3 U4.2
  Top 0.61: X2.1 40.8,6.8 39.9,7.7 36.5,7.7 35.6,6.8 35.6,6.5
  Bottom 0.61: R16.1 45.63,7.92 D4.2 43.65,6.8 X2.1
HD4
  Top 0.406: 55.34,18.3 55.34,17.94 U5.3 U5.2
  Top 0.61: X3.3 61.32,16.8 59.1,19.02 55.66,19.02 55.34,18.7 55.34,18.3
  Bottom 0.61: X3.3 63.7,16.8 65.1,18.2 D5.2 68.25,18.35 69.5,19.6 69.5,20.6 R22.1
HD5
  Top 0.406: 55.52,6.32 55.52,6.16 U6.3 U6.2
  Top 0.61: X3.1 61.4,6.8 60.56,7.64 56.24,7.64 55.52,6.92 55.52,6.32
  Bottom 0.61: X3.1 63.5,6.8 65.05,8.35 D6.2 67.31,8.35 R24.1
HD6
  Top 0.406: 75.42,18.08 75.42,17.84 U7.3 U7.2
  Top 0.61: X4.3 81.02,16.8 78.96,18.86 75.8,18.86 75.42,18.48 75.42,18.08
  Bottom 0.61: X4.3 83.7,16.8 85.2,18.3 D7.2 86.39,17.16 R30.1
HD7
  Top 0.406: 75.54,6.38 75.54,6.16 U8.3 U8.2
  Top 0.61: X4.1 80.98,6.8 80.28,7.5 76.2,7.5 75.56,6.86 75.56,6.4 75.54,6.38
  Bottom 0.61: X4.1 83.6,6.8 85.1,8.3 D8.2 86.85,8.35 R32.1
N$1  (via drill 0.6)
  Top 0.305: U10.3 6.75,18.09 v6.15,18.7
  Bottom 0.305: v6.15,18.7 6.15,17.55 6,17.4 6,16.85 R35.2 5.9,16.75 5.9,16.2 5.45,15.75 R1.2
SC0  (via drill 0.6)
  Top 0.305: 15.17,20.83 12.63,20.83 9.9,18.1 9.9,16.6 9,15.7 5.9,15.7 5.5,16.1 5.5,17.25 U10.5
  Top 0.406: U1.7 15.17,20.83 v15.6,20.4
  Bottom 0.406: v15.6,20.4 16.22,20.4 R3.1
  Bottom 0.61: R3.1 16.39,21.23 C13.1
SC1  (via drill 0.6)
  Top 0.305: C15.1 14.05,12 R7.1 15.05,11.35 15.2,11.2 15.2,10.28 U2.7 15.2,10.14 15.2,9 14.6,8.4 12.8,8.4 v12,9.2 | U10.20 5.46,12.36 5.6,12.5 8.6,12.5 9.8,11.3 v9.8,11.1
  Bottom 0.305: v9.8,11.1 12,11.1 v12,9.2
SC2  (via drill 0.6)
  Top 0.305: U10.7 4.16,15.54 5,14.7 25.2,14.7 29.3,18.8 30.4,18.8 31.7,20.1 34.6,20.1 35.3,20.8
  Top 0.406: U3.7 35.12,20.98 35.3,20.8 v35.8,20.3
  Bottom 0.406: R11.1 36.45,21.1 36.23,21.32 | 36.23,21.32 C17.1 | v35.8,20.3 35.8,20.9 36.23,21.32
SC3  (via drill 0.6)
  Top 0.305: C19.1 35.15,12.6 R13.1 35.2,12.17 35.2,10.26 U4.7 35.2,10.22 35.2,9.1 34.3,8.2 32.8,8.2 32.1,8.9 v32.1,9.6 | U10.18 4.16,12.86 4.8,13.5 26,13.5 v30.3,9.2
  Bottom 0.305: v30.3,9.2 31.7,9.2 v32.1,9.6
SC4  (via drill 0.6)
  Top 0.305: U10.9 2.85,19.36 3.2,19.7 5.2,19.7 6.4,20.9 11.25,20.9 12.15,21.8 12.15,23.85 14.9,26.6 47.44,26.6 49.36,24.68 49.36,22 50.62,20.74 54.88,20.74 55.02,20.88
  Top 0.406: U5.7 55.02,20.88 v55.56,20.34
  Bottom 0.406: R19.1 56.44,21.04 | 56.44,21.04 56.29,21.04 C21.1 | v55.56,20.34 55.74,20.34 56.44,21.04
SC5
  Top 0.305: U10.16 2.85,9.85 3.6,9.1 5.9,9.1 6.1,8.9 9.1,8.9 12,6 12,5.2 13.2,4 13.2,2.8 13.5,2.5 46.82,2.5 49.16,4.84 49.16,6.84 50.98,8.66 54.74,8.66 55.18,9.1 U6.7 | C23.1 54.47,12.56 R21.1 55.18,11.85 U6.7 | U6.7
SC6  (via drill 0.6)
  Top 0.305: U10.11 1.55,19.95 2.3,20.7 4.6,20.7 5.8,21.9 10.65,21.9 11.15,22.4 11.15,24.45 14.3,27.6 49.6,27.6 50.62,26.58 64.52,26.58 68.46,22.64 68.46,21.72 69.48,20.7 74.96,20.7 75.08,20.82
  Top 0.406: U7.7 75.08,20.82 75.08,20.66 v75.74,20
  Bottom 0.406: R27.1 76.35,21 76.22,21.14 | 76.22,21.14 C25.1 | v75.74,20 75.74,20.66 76.22,21.14
SC7
  Top 0.305: U10.14 1.55,9.54 3,8.1 5.4,8.1 5.6,7.9 8.4,7.9 11,5.3 11,4.6 12.2,3.4 12.2,2.2 13.1,1.3 47.3,1.3 48.58,2.58 63.86,2.58 69.3,8.02 74.04,8.02 75.2,9.18 75.2,10.22 U8.7 75.22,11.81 R29.1 74.55,12.48 C27.1
SCL  (via drill 0.6)
  Top 0.305: U10.22 6.75,9.86 v6.6,9.7
  Bottom 0.305: SV1.2 3.99,6.39 6.6,9 | 6.6,9 v6.6,9.7 | 6.6,9 6.6,8.75 R34.1
SD0  (via drill 0.6)
  Top 0.305: R2.1 11.53,18.43 v10.8,17.7 | v9.5,19.5 9.5,18.9 9.1,18.5 9.1,16.6 8.7,16.2 6.2,16.2 6.1,16.3 U10.4
  Top 0.406: R2.1 13.79,18.43 U1.1 14.5,16.4 14.9,16 v15.4,16
  Bottom 0.305: v10.8,17.7 10.8,18.2 v9.5,19.5
  Bottom 0.406: C12.1 15.52,16.02 v15.4,16
SD1
  Top 0.305: 14.7,5.72 U2.1 14.55,5.71 14.55,5 15.15,4.4 C14.1 | U10.19 4.8,12.5 5.3,13 10,13 10.3,12.7 10.3,12 10.6,11.7 10.6,9.4 12.4,7.6 13.05,7.6 R6.1
  Top 0.406: 14.55,5 14.55,6.65 13.7,7.5 13.15,7.5 R6.1
SD2  (via drill 0.6)
  Top 0.305: U10.6 4.8,15.7 5.3,15.2 25,15.2 29.6,19.8 30,19.8 v30.5,20.3 | v30.6,17.9 32.35,17.9 R10.1
  Top 0.406: v35.6,16 35.2,16 34.5,16.7 34.5,17.66 U3.1 34.48,17.71 33.7,18.5 33.25,18.5 R10.1
  Bottom 0.305: v30.5,20.3 30.5,18 v30.6,17.9
  Bottom 0.406: C16.1 v35.6,16
SD3
  Top 0.305: C18.1 35.15,4.25 34.6,4.8 | 34.6,4.8 34.6,5.8 U4.1 34.51,5.9 33.8,5.9 31.2,8.5 31.2,9.5 30.7,10 30.4,10 26.4,14 4.3,14 3.5,13.21 U10.17 | 34.6,4.8 34.05,4.8 R12.1
SD4  (via drill 0.6)
  Top 0.305: U10.8 3.5,19 3.7,19.2 5.5,19.2 6.7,20.4 11.45,20.4 12.65,21.6 12.65,23.55 15.2,26.1 47.18,26.1 48.84,24.44 48.84,21.32 51.58,18.58 52.89,18.58 R18.1
  Top 0.406: v55.36,16.08 54.82,16.08 54.32,16.58 54.32,17.56 | 54.32,17.56 U5.1 | 54.32,17.56 54.32,17.76 53.6,18.48 52.99,18.48 R18.1
  Bottom 0.61: C20.1 56.39,17.11 v55.36,16.08
SD5
  Top 0.305: U10.15 2.21,9.7 3.3,8.6 5.6,8.6 5.8,8.4 8.8,8.4 11.5,5.7 11.5,4.9 12.7,3.7 12.7,2.5 13.3,1.9 47.04,1.9 51.02,5.88 54.48,5.88 U6.1 54.52,4.94 54.78,4.68 | C22.1 55.19,4.27 54.78,4.68 | R20.1 54.4,4.3 54.78,4.68
SD6  (via drill 0.6)
  Top 0.305: U10.10 2.21,19.61 2.8,20.2 4.9,20.2 6.1,21.4 11,21.4 11.65,22.05 11.65,24.15 14.6,27.1 49.32,27.1 50.34,26.08 64.26,26.08 67.9,22.44 67.9,21.56 71,18.46 R26.1
  Top 0.406: U7.1 74.42,16.18 74.64,15.96 v76.08,15.96 | U7.1 | U7.1 74.3,17.52 73.4,18.42 72.89,18.42 R26.1
  Bottom 0.406: C24.1 76.12,16 v76.08,15.96
SD7
  Top 0.305: 0.81,11.2 U10.13 0.8,9.5 2.7,7.6 5.1,7.6 5.3,7.4 8,7.4 10.5,4.9 10.5,4.3 11.7,3.1 11.7,1.9 12.9,0.7 47.54,0.7 48.84,2 64.1,2 67.96,5.86 74.52,5.86 U8.1 74.54,5.8 74.54,4.88 | C26.1 75.27,4.15 74.54,4.88 | R28.1 73.9,4.24 74.54,4.88
SDA  (via drill 0.6)
  Top 0.305: U10.23 7.41,10.39 v7.9,9.9 | SV1.6 5.3,2.72 5.3,6.3 v5.6,6.6
  Bottom 0.305: v7.9,9.9 7.9,7.5 | 7.9,7.5 7.7,7.3 6.3,7.3 v5.6,6.6 | R36.1 10.4,7.8 9.9,7.3 8.1,7.3 7.9,7.5

### Text on the board
tNames: CH0 | CH2 | CH4 | CH6 | SCL | SDA | CH1 | CH3 | CH5 | CH7
bNames: ADR1 | ADR0